# EAGLE design Empty_Shield_SMD-v13 (EAGLE 7.1.0)
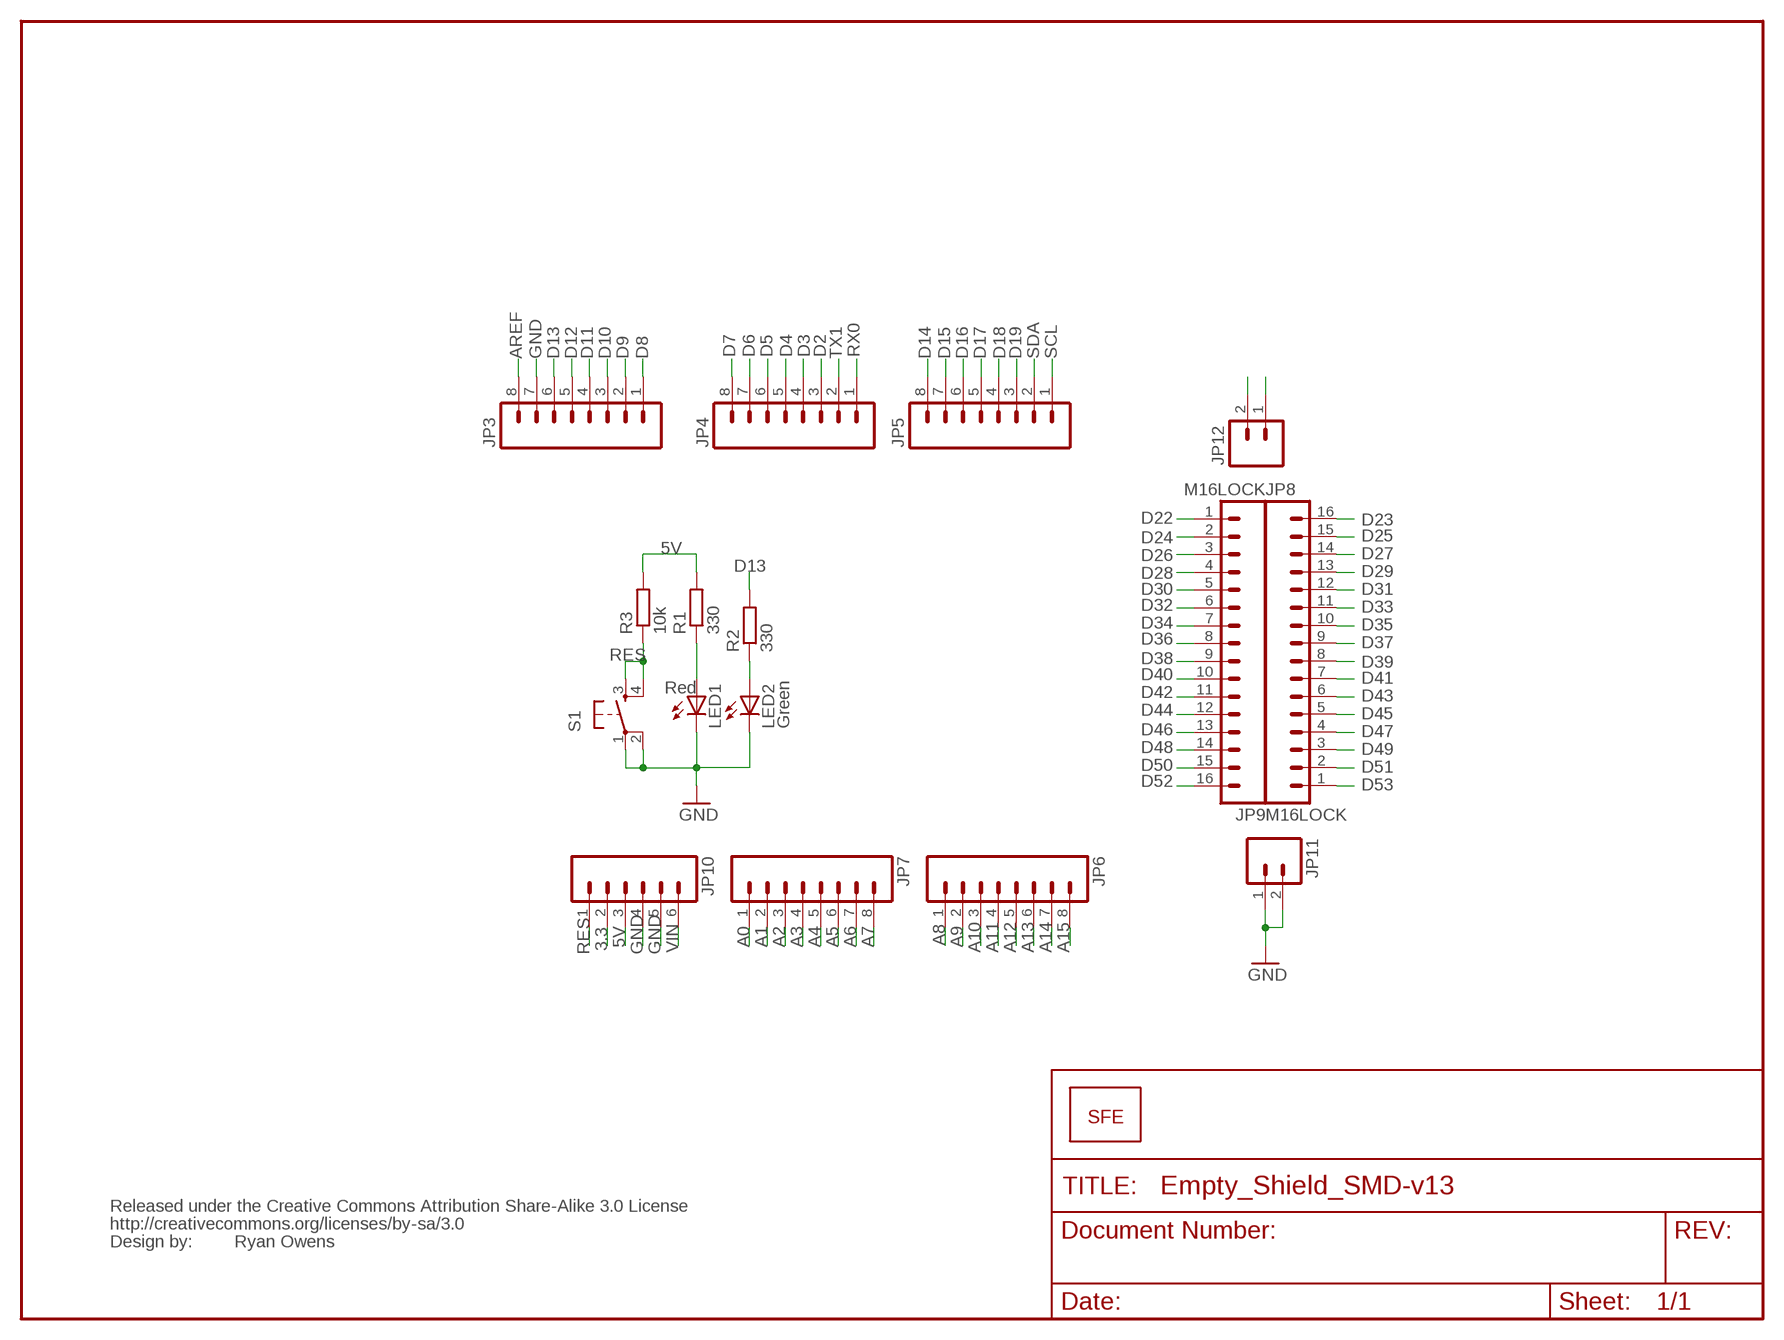
[diagram p0: schematic, sheet 1]

## Parts
JP3  M08LOCK  [1X08_LOCK]
JP4  M08LOCK  [1X08_LOCK]
JP5  M08LOCK  [1X08_LOCK]
JP6  M08LOCK  [1X08_LOCK]
JP7  M08LOCK  [1X08_LOCK]
JP8  M16LOCK  [1X16_LOCK]
JP9  M16LOCK  [1X16_LOCK]
JP10  M06LOCK  [1X06_LOCK]
JP11  M02LOCK  [1X02_LOCK]
JP12  M02LOCK  [1X02_LOCK]
LED1  Red  LEDCHIP-LED0805  [CHIP-LED0805]
LED2  Green  LEDCHIP-LED0805  [CHIP-LED0805]
R1  330  R-EU_R0805  [R0805]
R2  330  R-EU_R0805  [R0805]
R3  10k  R-EU_R0805  [R0805]
S1  TAC_SWITCHPTH  [TACTILE-PTH]
U$1  LOGO-SFENEW  [SFE-NEW-WEBLOGO]
U$2  CREATIVE_COMMONS  [CREATIVE_COMMONS]

## Nets
3.3: JP10.2
5V: JP10.3 R1.2 R3.2
5V@1: JP12.1 JP12.2
A0: JP7.1
A1: JP7.2
A2: JP7.3
A3: JP7.4
A4: JP7.5
A5: JP7.6
A6: JP7.7
A7: JP7.8
A8: JP6.1
A9: JP6.2
A10: JP6.3
A11: JP6.4
A12: JP6.5
A13: JP6.6
A14: JP6.7
A15: JP6.8
AREF: JP3.8
D2: JP4.3
D3: JP4.4
D4: JP4.5
D5: JP4.6
D6: JP4.7
D7: JP4.8
D8: JP3.1
D9: JP3.2
D10: JP3.3
D11: JP3.4
D12: JP3.5
D13: JP3.6 R2.2
D14: JP5.8
D15: JP5.7
D16: JP5.6
D17: JP5.5
D18: JP5.4
D19: JP5.3
D22: JP9.1
D23: JP8.16
D24: JP9.2
D25: JP8.15
D26: JP9.3
D27: JP8.14
D28: JP9.4
D29: JP8.13
D30: JP9.5
D31: JP8.12
D32: JP9.6
D33: JP8.11
D34: JP9.7
D35: JP8.10
D36: JP9.8
D37: JP8.9
D38: JP9.9
D39: JP8.8
D40: JP9.10
D41: JP8.7
D42: JP9.11
D43: JP8.6
D44: JP9.12
D45: JP8.5
D46: JP9.13
D47: JP8.4
D48: JP9.14
D49: JP8.3
D50: JP9.15
D51: JP8.2
D52: JP9.16
D53: JP8.1
GND: JP3.7 JP10.4 JP10.5 JP11.1 JP11.2 LED1.C LED2.C S1.1 S1.2
N$126: LED1.A R1.1
N$127: LED2.A R2.1
RES: JP10.1 R3.1 S1.3 S1.4
RX0: JP4.1
SCL: JP5.1
SDA: JP5.2
TX1: JP4.2
VIN: JP10.6

## Notes on the sheet
- Ryan Owens

## Library data of the parts
JP3-JP7 = SparkFun:M08: Header 8 Standard 8-pin 0.1" header. Use with straight break away headers (SKU : PRT-00116), right angle break away headers (PRT-00553), swiss pins (PRT-00743), machine pins (PRT-00117), and female headers (PRT-00115).
JP8 JP9 = SparkFun:M16
JP10 = SparkFun:M06: Header 6 Standard 6-pin 0.1" header. Use with straight break away headers (SKU : PRT-00116), right angle break away headers (PRT-00553), swiss pins (PRT-00743), machine pins (PRT-00117), and female headers (PRT-00115). Molex polarized connector foot print use with SKU : PRT-08094 with associated crimp pins and housings. NOTES ON THE VARIANTS LOCK and LOCK_LONGPADS... This footprint was designed to help hold the alignment of a through-hole component (i.e. 6-pin header) while soldering it into place. You may notice that each hole has been shifted either up or down by 0.005 of an inch from it's more standard position (which is a perfectly straight line). This slight alteration caused the pins (the squares in the middle) to touch the edges of the holes. Because they are alternating, it causes a "brace" to hold the component in place. 0.005 has proven to be the perfect amount of "off-center" position when using our standard breakaway headers. Although looks a little odd when you look at the bare footprint, once you have a header in there, the alteration is very hard to notice. Also, if you push a header all the way into place, it is covered up entirely on the bottom side. This idea of altering the position of holes to aid alignment will be further integrated into the Sparkfun Library for other footprints. It can help hold any component with 3 or more connection pins.
JP11 JP12 = SparkFun:M02: Header 2 Standard 2-pin 0.1" header. Use with straight break away headers (SKU : PRT-00116), right angle break away headers (PRT-00553), swiss pins (PRT-00743), machine pins (PRT-00117), and female headers (PRT-00115). Molex polarized connector foot print use with SKU : PRT-08233 with associated crimp pins and housings.
LED1 LED2 = led:LED: LED OSRAM: - CHIPLED LG R971, LG N971, LY N971, LG Q971, LY Q971, LO R971, LY R971 LH N974, LH R974 LS Q976, LO Q976, LY Q976 LO Q996 - Hyper CHIPLED LW Q18S LB Q993, LB Q99A, LB R99A - SideLED LS A670, LO A670, LY A670, LG A670, LP A670 LB A673, LV A673, LT A673, LW A673 LH A674 LY A675 LS A676, LA A676, LO A676, LY A676, LW A676 LS A679, LY A679, LG A679 - Hyper Micro SIDELED® LS Y876, LA Y876, LO Y876, LY Y876 LT Y87S - SmartLED LW L88C, LW L88S LB L89C, LB L89S, LG L890 LS L89K, LO L89K, LY L89K LS L896, LA L896, LO L896, LY L896 - TOPLED LS T670, LO T670, LY T670, LG T670, LP T670 LSG T670, LSP T670, LSY T670, LOP T670, LYG T670 LG T671, LOG T671, LSG T671 LB T673, LV T673, LT T673, LW T673 LH T674 LS T676, LA T676, LO T676, LY T676, LB T676, LH T676, LSB T676, LW T676 LB T67C, LV T67C, LT T67C, LS T67K, LO T67K, LY T67K, LW E67C LS E67B, LA E67B, LO E67B, LY E67B, LB E67C, LV E67C, LT E67C LW T67C LS T679, LY T679, LG T679 LS T770, LO T770, LY T770, LG T770, LP T770 LB T773, LV T773, LT T773, LW T773 LH T774 LS E675, LA E675, LY E675, LS T675 LS T776, LA T776, LO T776, LY T776, LB T776 LHGB T686 LT T68C, LB T68C - Hyper Mini TOPLED® LB M676 - Mini TOPLED Santana® LG M470 LS M47K, LO M47K, LY M47K Source: http://www.osram.convergy.de LUXEON: - LUMILED® LXK2-PW12-R00, LXK2-PW12-S00, LXK2-PW14-U00, LXK2-PW14-V00 LXK2-PM12-R00, LXK2-PM12-S00, LXK2-PM14-U00 LXK2-PE12-Q00, LXK2-PE12-R00, LXK2-PE12-S00, LXK2-PE14-T00, LXK2-PE14-U00 LXK2-PB12-K00, LXK2-PB12-L00, LXK2-PB12-M00, LXK2-PB14-N00, LXK2-PB14-P00, LXK2-PB14-Q00 LXK2-PR12-L00, LXK2-PR12-M00, LXK2-PR14-Q00, LXK2-PR14-R00 LXK2-PD12-Q00, LXK2-PD12-R00, LXK2-PD12-S00 LXK2-PH12-R00, LXK2-PH12-S00 LXK2-PL12-P00, LXK2-PL12-Q00, LXK2-PL12-R00 Source: www.luxeon.com KINGBRIGHT: KA-3528ASYC Source: www.kingbright.com
R1-R3 = rcl:R-EU_: RESISTOR, European symbol
S1 = SparkFun:TAC_SWITCH: Momentary Switch Button commonly used for reset or general input. Spark Fun Electronics SKU : COM-00097
U$1 = SparkFun:LOGO-SFE: Spark Fun Electronics PCB Logo This is the standard Spark Fun Electronics PCB logo.
U$2 = SparkFun:CREATIVE_COMMONS

## Board
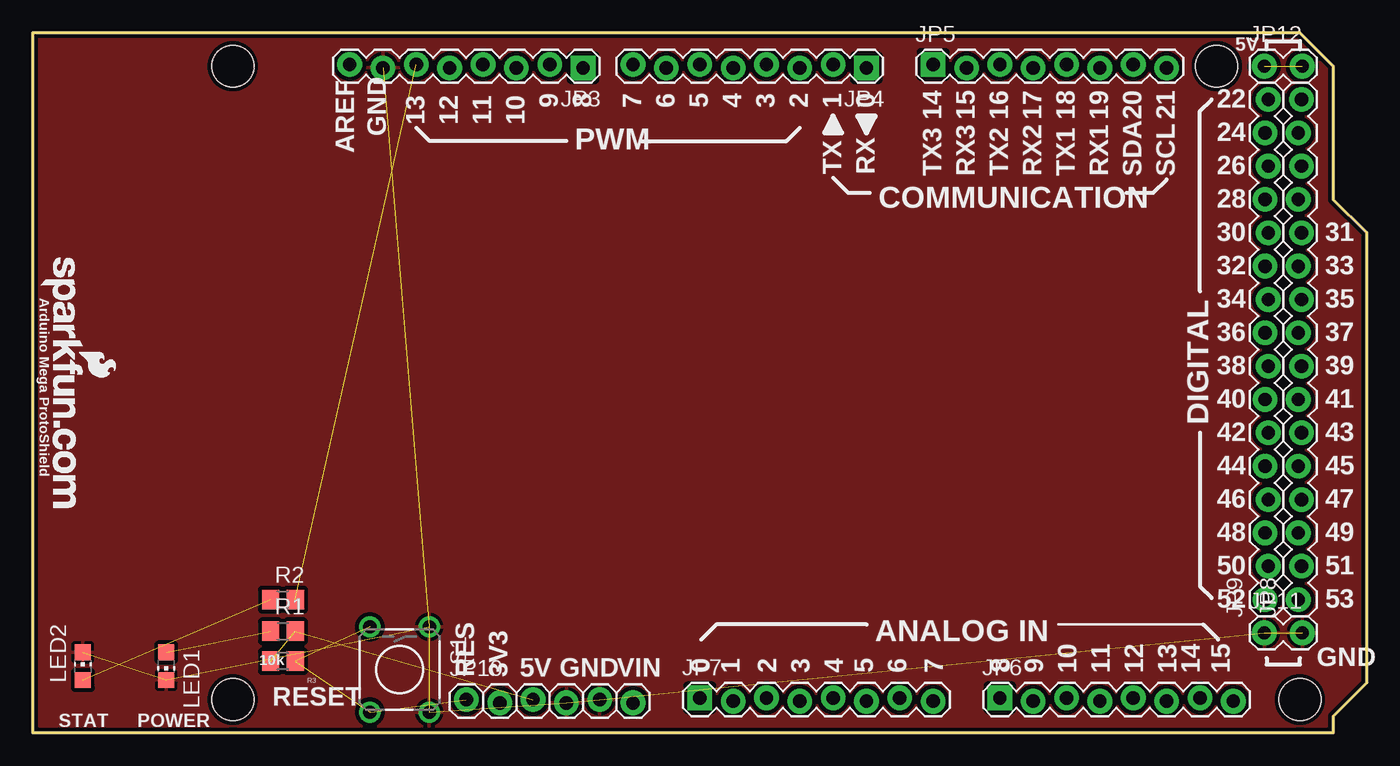
[diagram p1: board, top side]
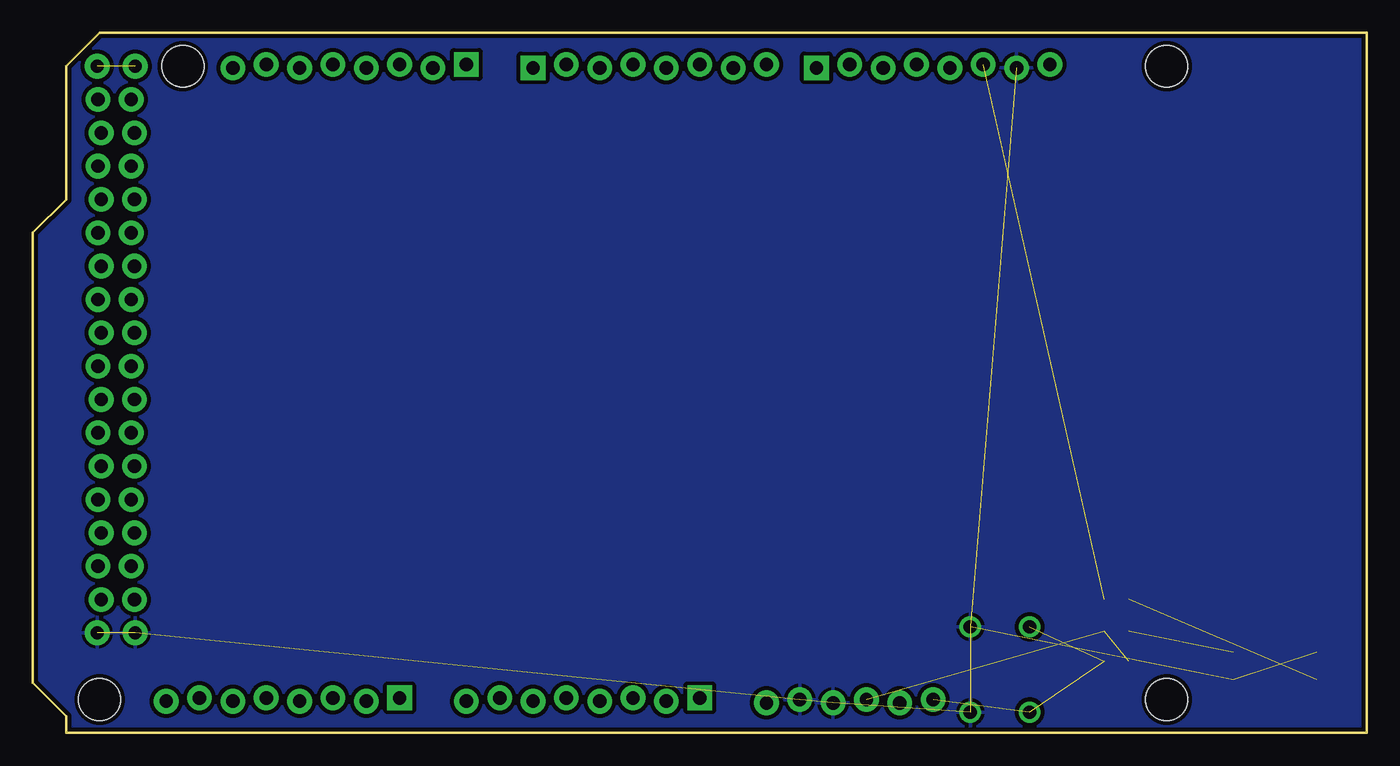
[diagram p2: board, bottom side, seen from below]

Size 101.6 x 53.34 mm. Coordinates in mm from the lower left corner, seen from the top.
Outline: 0,0 99.06,0 99.06,1.27 101.6,3.81 101.6,38.1 99.06,40.64 99.06,50.8 96.52,53.34 0,53.34 0,0
Copper layers (1*16): Top 0.035mm / dielectric 1.5mm / Bottom 0.035mm
Design rules "SparkFun": minimum track width 8mil, minimum drill 20mil, track to track 8mil, track to pad 8mil, pad to pad 8mil, via to via 8mil, smd to smd 8mil, copper to edge 10mil, drill to drill 8mil, minimum pad ring 12mil, minimum via ring 10mil, stop-mask expansion 4mil, vias tented up to drill 25mil, thermal gap 10mil
Holes 3.2 mm at 15.24,50.8 15.24,2.54 90.17,50.8 96.52,2.54

### Footprints (pad centres in the part's own frame; a part is rotated, then mirrored left to right if it is on the bottom)
1X08_LOCK = drill 1.016 pad 1.88 square: 1 0,0.127 | drill 1.016 pad 1.88: 2 2.54,-0.127; 3 5.08,0.127; 4 7.62,-0.127; 5 10.16,0.127; 6 12.7,-0.127; 7 15.24,0.127; 8 17.78,-0.127
1X16_LOCK = drill 1.016 pad 1.88: 1 0,0.127; 2 2.54,-0.127; 3 5.08,0.127; 4 7.62,-0.127; 5 10.16,0.127; 6 12.7,-0.127; 7 15.24,0.127; 8 17.78,-0.127; 9 20.32,0.127; 10 22.86,-0.127; 11 25.4,0.127; 12 27.94,-0.127; 13 30.48,0.127; 14 33.02,-0.127; 15 35.56,0.127; 16 38.1,-0.127
1X06_LOCK = drill 1.016 pad 1.88: 1 0,0; 2 2.54,-0.254; 3 5.08,0; 4 7.62,-0.254; 5 10.16,0; 6 12.7,-0.254
1X02_LOCK = drill 1.016 pad 1.88: 1 -0.178,0; 2 2.718,0
CHIP-LED0805 = smd 1.2 x 1.2: A 0,-1.05; C 0,1.05
R0805 = smd 1.3 x 1.5: 1 -0.95,0; 2 0.95,0
TACTILE-PTH = drill 1.016: 1 -3.251,2.261; 2 3.251,2.261; 3 -3.251,-2.261; 4 3.251,-2.261

### Placement (x,y rotation side)
JP3  41.91,50.8 180 top
JP4  63.5,50.8 180 top
JP5  68.58,50.8 0 top
JP6  73.66,2.54 0 top
JP7  50.8,2.54 0 top
JP8  96.52,10.16 90 top
JP9  93.98,10.16 90 top
JP10  33.02,2.54 0 top
JP11  93.98,7.62 0 top
JP12  93.98,50.8 0 top
LED1  10.16,5.08 180 top
LED2  3.81,5.08 0 top
R1  19.05,7.75 0 top
R2  19.05,10.16 0 top
R3  19.05,5.46 180 top
S1  27.94,4.83 270 top
U$1  0.64,36.2 270 top
U$2  20.32,-7.62 0 top  (outside the outline)

### Tracks (layer width: path | path; a pad name or v marks a point on that pad's centre or on a via)
5V  (2 unrouted)
5V@1  (1 unrouted)
D13  (1 unrouted)
GND  (8 unrouted)
  pour Bottom (isolate 0.305): 0,0 99.06,0 99.06,1.27 101.6,3.81 101.6,38.1 99.06,40.64 99.06,50.8 96.52,53.34 0,53.34 0,2.54
  pour Top (isolate 0.305): 0,0 99.06,0 99.06,1.27 101.6,3.81 101.6,38.1 99.06,40.64 99.06,50.8 96.52,53.34 0,53.34 0,2.54
N$126  (1 unrouted)
N$127  (1 unrouted)
RES  (3 unrouted)

### Text on the board
tPlace: 5V | 9 | 8 | 7 | 6 | 5 | 4 | 3 | 2 | 1 | 0 | 22 | 14 | 15 | 16 | 17 | 18 | 19 | 20 | 21 | 13 | 12 | 11 | 10 | GND | 24 | AREF | PWM | TX | RX | 26 | TX3 | RX3 | TX2 | RX2 | TX1 | RX1 | SDA | SCL | COMMUNICATION | 28 | 30 | 31 | 32 | 33 | Arduino Mega ProtoShield | 34 | 35 | 36 | 37 | 38 | 39 | 40 | 41 | DIGITAL | 42 | 43 | 44 | 45 | 46 | 47 | 48 | 49 | 50 | 51 | 52 | 53 | ANALOG IN | 0 | 1 | 2 | 3 | 4 | 5 | 6 | 7 | 8 | 9 | 10 | 11 | 12 | 13 | 14 | 15 | GND | RES | 3V3 | 5V | GND | VIN | RESET | STAT | POWER